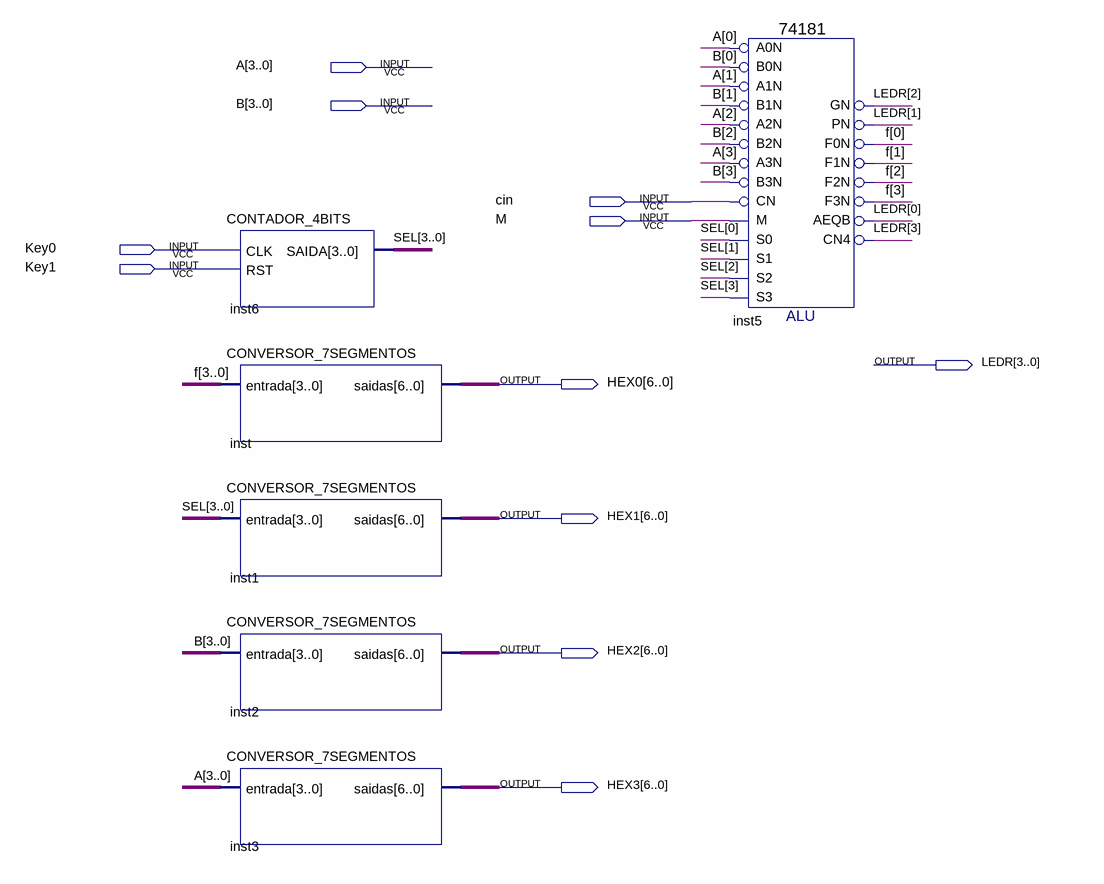
[diagram p0: schematic sheet]
// Quartus schematic ULA.bdf as structural Verilog: 6 symbols, 11 pins
module ULA (
  input  [3:0] A,
  input  [3:0] B,
  input  cin,
  input  M,
  input  Key0,
  input  Key1,
  output [3:0] LEDR,
  output [6:0] HEX0,
  output [6:0] HEX1,
  output [6:0] HEX2,
  output [6:0] HEX3
);

  wire [3:0] f, SEL;

  CONTADOR_4BITS inst6 (.CLK(Key0), .RST(Key1), .SAIDA(SEL));
  CONVERSOR_7SEGMENTOS inst (.entrada(f), .saidas(HEX0));
  CONVERSOR_7SEGMENTOS inst1 (.entrada(SEL), .saidas(HEX1));
  CONVERSOR_7SEGMENTOS inst2 (.entrada(B), .saidas(HEX2));
  CONVERSOR_7SEGMENTOS inst3 (.entrada(A), .saidas(HEX3));
  \74181  inst5 (
    .B0N(B[0]), .A0N(A[0]), .A1N(A[1]), .B1N(B[1]), .A3N(A[3]), .B2N(B[2]), .A2N(A[2]), .M(M), .CN(cin),
    .B3N(B[3]), .S2(SEL[2]), .S1(SEL[1]), .S0(SEL[0]), .S3(SEL[3]), .PN(LEDR[1]), .GN(LEDR[2]), .F3N(f[3]),
    .F1N(f[1]), .F0N(f[0]), .AEQB(LEDR[0]), .CN4(LEDR[3]), .F2N(f[2]));
endmodule
